# EAGLE design Projeto_Sistemas_Embarcados (EAGLE 9.7.0)
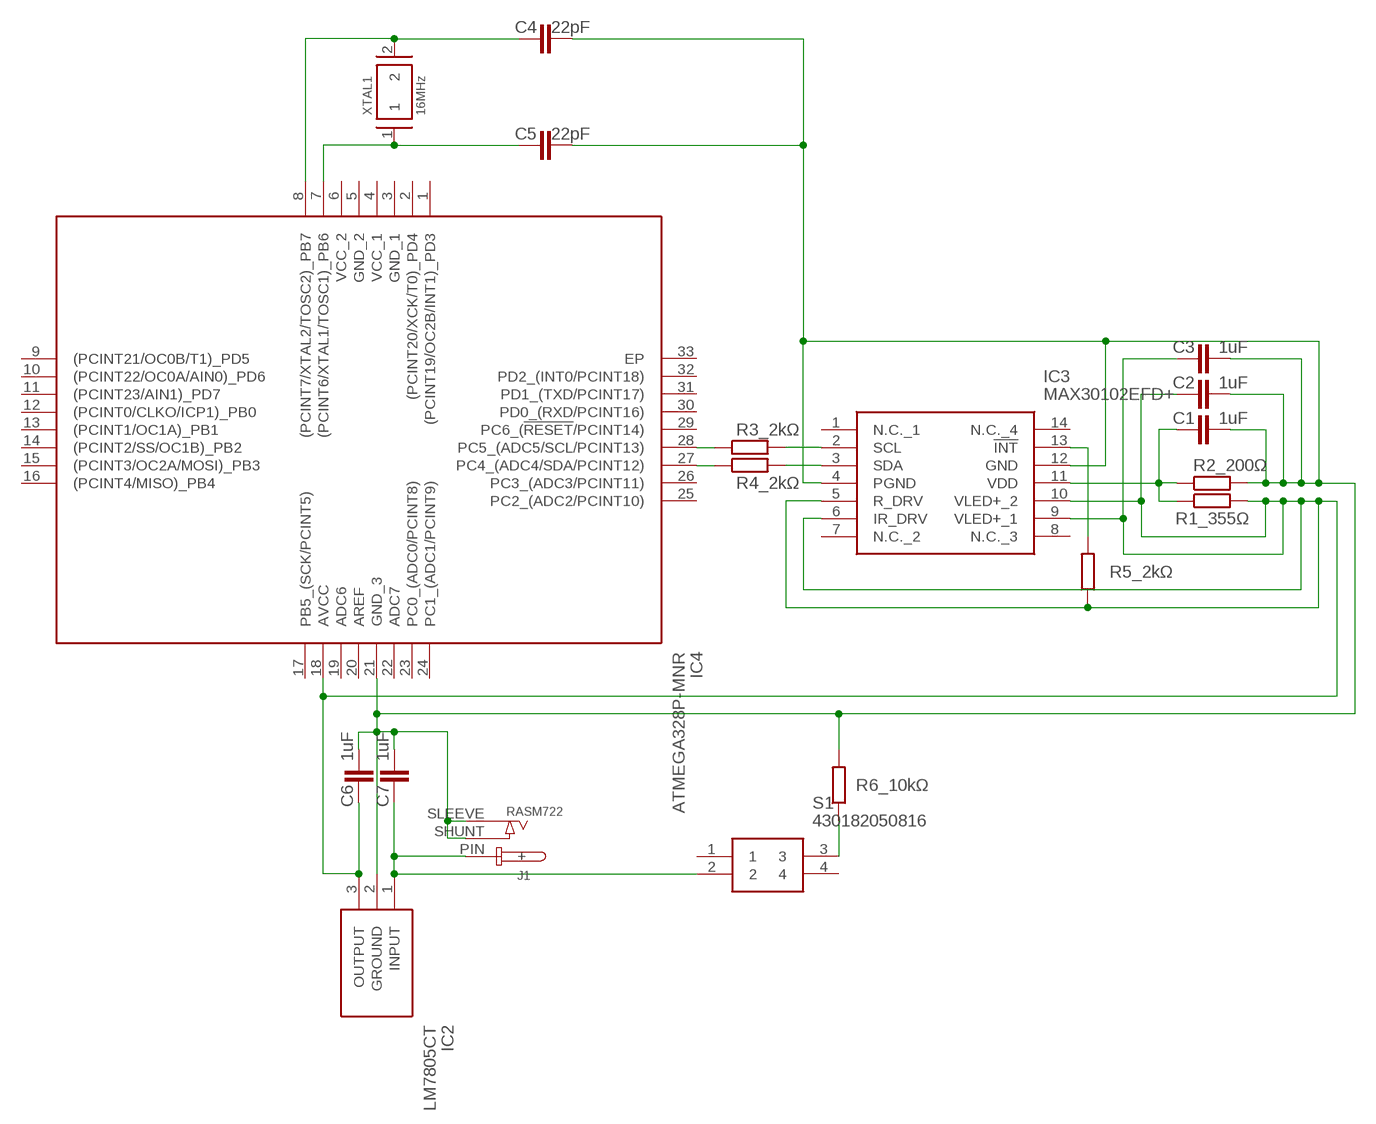
[diagram p0: schematic, sheet 1]

## Parts
C1  1uF  C_CHIP-0402(1005-METRIC)  [CAPC1005X60]
C2  1uF  C_CHIP-0402(1005-METRIC)  [CAPC1005X60]
C3  1uF  C_CHIP-0402(1005-METRIC)  [CAPC1005X60]
C4  22pF  C_CHIP-0402(1005-METRIC)  [CAPC1005X60]
C5  22pF  C_CHIP-0402(1005-METRIC)  [CAPC1005X60]
C6  1uF  C_CHIP-0402(1005-METRIC)  [CAPC1005X60]
C7  1uF  C_CHIP-0402(1005-METRIC)  [CAPC1005X60]
IC2  LM7805CT  [TO254P470X1028X1955-3P]
IC3  MAX30102EFD+  [14-LEAD-OESIP]
IC4  ATMEGA328P-MNR  [QFN50P500X500X100-33N]
J1  RASM722  [RASM722X]
R1  R1_355Ω  R_CHIP-2512(6332-METRIC)  [RESC6332X71]
R2  R2_200Ω  R_CHIP-2512(6332-METRIC)  [RESC6332X71]
R3  R3_2kΩ  R_CHIP-2512(6332-METRIC)  [RESC6332X71]
R4  R4_2kΩ  R_CHIP-2512(6332-METRIC)  [RESC6332X71]
R5  R5_2kΩ  R_CHIP-2512(6332-METRIC)  [RESC6332X71]
R6  R6_10kΩ  R_CHIP-2512(6332-METRIC)  [RESC6332X71]
S1  430182050816  [430182070816]
XTAL1  16MHz  FC4SDFREQUENCY_16MHZ  [XTAL1170X500X450N]

## Nets
5V: C2.1 C3.1 C6.1 IC2.3(OUTPUT) IC3.5(R_DRV) IC3.6(IR_DRV) IC3.9(VLED+_1) IC3.10(VLED+_2) IC4.18(AVCC) R1.2 R5.1
GND: C1.2 C2.2 C3.2 C4.2 C5.2 C6.2 C7.2 IC2.2(GROUND) IC3.4(PGND) IC3.12(GND) IC4.21(GND_3) J1.SHUNT(-) J1.SLEEVE(NEG) R2.2 R6.2
N$1: C1.1 IC3.11(VDD) R1.1 R2.1
N$2: C4.1 IC4.8((PCINT7/XTAL2/TOSC2)_PB7) XTAL1.2
N$3: C5.1 IC4.7((PCINT6/XTAL1/TOSC1)_PB6) XTAL1.1
N$4: IC3.2(SCL) R3.2
N$6: IC3.3(SDA) R4.2
N$7: R6.1 S1.3
N$8: IC3.13(!INT) R5.2
N$9: C7.1 IC2.1(INPUT) J1.PIN(+) S1.2
SCL: IC4.28(PC5_(ADC5/SCL/PCINT13)) R3.1
SDA: IC4.27(PC4_(ADC4/SDA/PCINT12)) R4.1
Unconnected: IC3.1(N.C._1) IC3.7(N.C._2) IC3.8(N.C._3) IC3.14(N.C._4) IC4.1((PCINT19/OC2B/INT1)_PD3) IC4.2((PCINT20/XCK/T0)_PD4) IC4.3(GND_1) IC4.4(VCC_1) IC4.5(GND_2) IC4.6(VCC_2) IC4.9((PCINT21/OC0B/T1)_PD5) IC4.10((PCINT22/OC0A/AIN0)_PD6) IC4.11((PCINT23/AIN1)_PD7) IC4.12((PCINT0/CLKO/ICP1)_PB0) IC4.13((PCINT1/OC1A)_PB1) IC4.14((PCINT2/SS/OC1B)_PB2) IC4.15((PCINT3/OC2A/MOSI)_PB3) IC4.16((PCINT4/MISO)_PB4) IC4.17(PB5_(SCK/PCINT5)) IC4.19(ADC6) IC4.20(AREF) IC4.22(ADC7) IC4.23(PC0_(ADC0/PCINT8)) IC4.24(PC1_(ADC1/PCINT9)) IC4.25(PC2_(ADC2/PCINT10)) IC4.26(PC3_(ADC3/PCINT11)) IC4.29(PC6_(!RESET!/PCINT14)) IC4.30(PD0_(RXD/PCINT16)) IC4.31(PD1_(TXD/PCINT17)) IC4.32(PD2_(INT0/PCINT18)) IC4.33(EP) S1.1 S1.4

## Library data of the parts
C1-C7 = Capacitor:C: Capacitor - Generic; CATEGORY: Capacitor
IC2 = LM7805CT:LM7805CT: Linear voltage regulator,LM7805CT 5V 1A Source: Datasheet <http://www.ti.com/lit/ds/symlink/lm340.pdf>; ARROW_PART_NUMBER: LM7805CT; ARROW_PRICE-STOCK: https://www.arrow.com/en/products/lm7805ct/texas-instruments; DESCRIPTION: Linear voltage regulator,LM7805CT 5V 1A; HEIGHT: 4.7mm; MANUFACTURER_NAME: Texas Instruments; MANUFACTURER_PART_NUMBER: LM7805CT; MOUSER_PART_NUMBER: 926-LM7805CT; MOUSER_PRICE-STOCK: https://www.mouser.co.uk/ProductDetail/Texas-Instruments/LM7805CT?qs=QbsRYf82W3EaqXeMDVwIfQ%3D%3D
IC3 = MAX30102EFD:MAX30102EFD+: MAXIM INTEGRATED PRODUCTS - MAX30102EFD+ - PULSE OXIMETER/HEART RATE SENSOR, OESIP Source: Datasheet <https://datasheets.maximintegrated.com/en/ds/MAX30102.pdf>; DESCRIPTION: MAXIM INTEGRATED PRODUCTS - MAX30102EFD+ - PULSE OXIMETER/HEART RATE SENSOR, OESIP; HEIGHT: mm; MANUFACTURER_NAME: Maxim Integrated; MANUFACTURER_PART_NUMBER: MAX30102EFD+; MOUSER_PART_NUMBER: 700-MAX30102EFD+; MOUSER_PRICE-STOCK: https://www.mouser.co.uk/ProductDetail/Maxim-Integrated/MAX30102EFD%2b?qs=nVS1qgv%252BQrk9UYEvS27V%2Fg%3D%3D
IC4 = ATMEGA328P:ATMEGA328P-MNR: 8-bit Microcontrollers - MCU AVR 32K FLSH 2K SRAM 1KB EE-20 MHZ 105C Source: Datasheet <http://ww1.microchip.com/downloads/en/DeviceDoc/ATmega48A-PA-88A-PA-168A-PA-328-P-DS-DS40002061A.pdf>; ARROW_PART_NUMBER: ATMEGA328P-MNR; ARROW_PRICE-STOCK: https://www.arrow.com/en/products/atmega328p-mnr/microchip-technology?region=nac; DESCRIPTION: 8-bit Microcontrollers - MCU AVR 32K FLSH 2K SRAM 1KB EE-20 MHZ 105C; HEIGHT: 1mm; MANUFACTURER_NAME: Microchip; MANUFACTURER_PART_NUMBER: ATMEGA328P-MNR; MOUSER_PART_NUMBER: 556-ATMEGA328P-MNR; MOUSER_PRICE-STOCK: https://www.mouser.co.uk/ProductDetail/Microchip-Technology-Atmel/ATMEGA328P-MNR?qs=6Dg1WZIWLC5fsr6lNbxG3A%3D%3D
J1 = Connector:RASM722: CONN PWR JACK 2.1X5.5MM SOLDER Manufacturer's datasheet <http://www.switchcraft.com/Documents/EDG4.pdf#page=135>; CREATED_BY: PCBLayout.com; DIGI-KEY_PART_NO: RASM722X-ND; MANUFACTURER: Switchcraft Inc.; MPN: RASM722X
R1-R6 = Resistor:R: Resistor Fixed - Generic; CATEGORY: Resistor; SUB-CATEGORY: Fixed
S1 = button:430182050816: Black Tactile Tactile Switch, NO 50 mA 1.6mm Surface Mount Source: Datasheet <http://katalog.we-online.de/em/datasheet/4301x2xxx8x6.pdf>; DESCRIPTION: Black Tactile Tactile Switch, NO 50 mA 1.6mm Surface Mount; HEIGHT: mm; MANUFACTURER_NAME: Wurth Elektronik; MANUFACTURER_PART_NUMBER: 430182050816; MOUSER_PART_NUMBER: 710-430182050816; MOUSER_PRICE-STOCK: https://www.mouser.co.uk/ProductDetail/Wurth-Elektronik/430182050816?qs=wr8lucFkNMUyle0jQPgWGw%3D%3D
XTAL1 = Frequency-Source:FC4SD: CRYSTAL 8.0000MHZ 20PF SMD 8MHz ±30ppm Crystal 20pF 80 Ohms HC-49/US Datasheet <https://www.foxonline.com/pdfs/C4SD.pdf>; CATEGORY: Resistance Weld; DESCRIPTION: SMD Crystal; FREQUENCY: 16MHZ; MANUFRACTURER: Fox Electronics; MPN: FC4SDCBMF16.0-T1; OPERATING_TEMPERATURE: -20*C to 70*c; PART_STATUS: Active; ROHS_COMPLIANT: COMPLIANT; SERIES: C4SD; SUB_CATEGORY: Resistance Weld SMD Crystal; TOLERANCE: ±30ppm; TYPE: Crystal

## Board
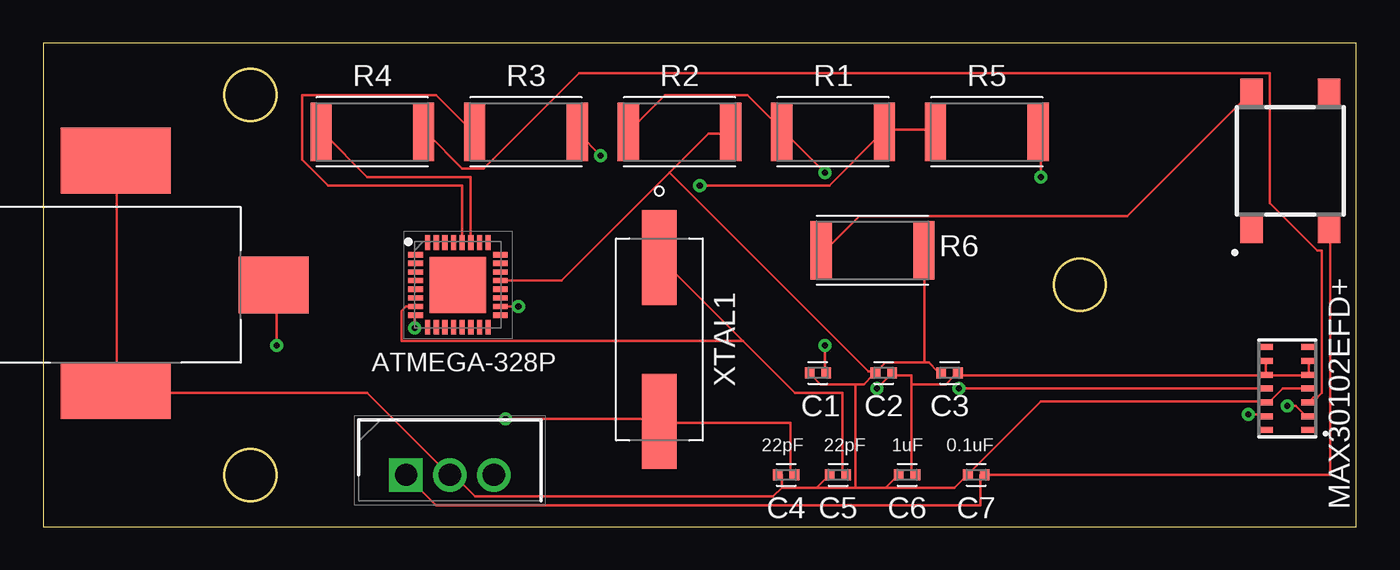
[diagram p1: board, top side]
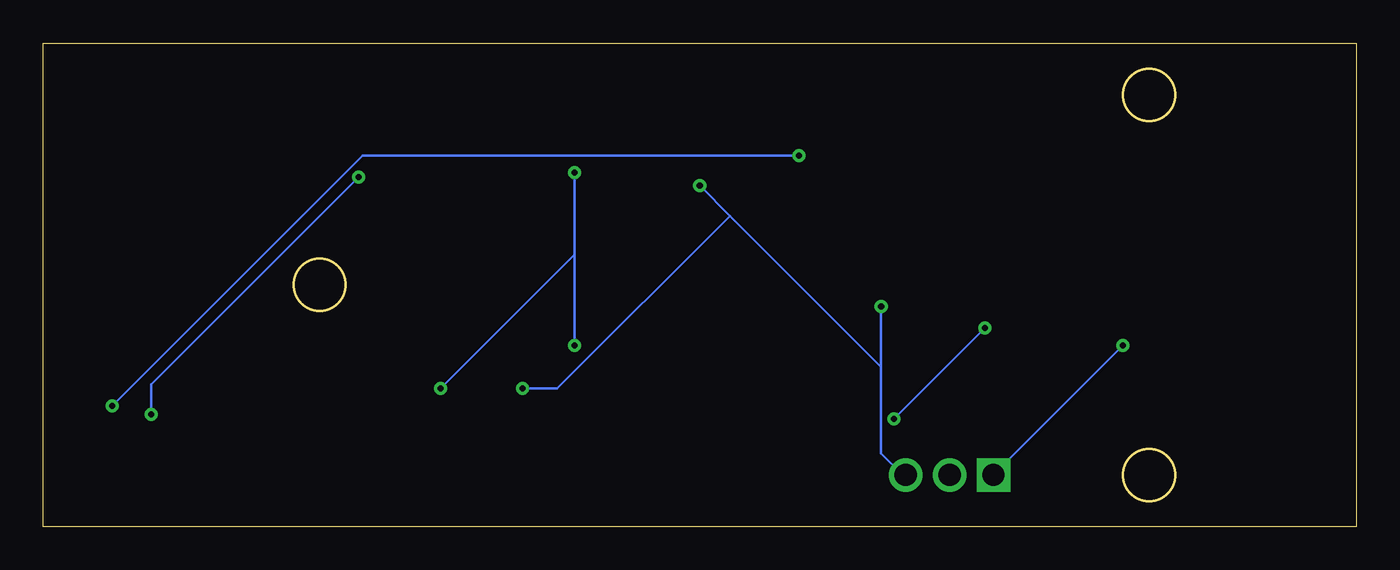
[diagram p2: board, bottom side, seen from below]

Size 76 x 28 mm. Coordinates in mm from the lower left corner, seen from the top.
Outline: 0,0 76,0 76,28 0,28 0,0
Outline: circle at 60,14 radius 1.5
Outline: circle at 12,25 radius 1.5
Outline: circle at 12,3 radius 1.5
Copper layers (1*16): Top 0.035mm / dielectric 1.5mm / Bottom 0.035mm
Design rules "default": minimum track width 6mil, minimum drill 0.35mm, track to track 6mil, track to pad 6mil, pad to pad 6mil, via to via 6mil, smd to smd 6mil, copper to edge 40mil, drill to drill 6mil, minimum pad ring 10mil, minimum via ring 8mil, stop-mask expansion 4mil, vias tented up to drill 0mil, thermal gap 10mil

### Footprints (pad centres in the part's own frame; a part is rotated, then mirrored left to right if it is on the bottom)
CAPC1005X60 = smd 0.56 x 0.629: 1 -0.485,0; 2 0.485,0
TO254P470X1028X1955-3P = drill 1.29 pad 1.935 square: 1 0,0 | drill 1.29 pad 1.935: 2 2.54,0; 3 5.08,0
14-LEAD-OESIP = smd 0.75 x 0.35: 1 -1.2,2.4; 2 -1.2,1.6; 3 -1.2,0.8; 4 -1.2,0; 5 -1.2,-0.8; 6 -1.2,-1.6; 7 -1.2,-2.4; 8 1.2,-2.4; 9 1.2,-1.6; 10 1.2,-0.8; 11 1.2,0; 12 1.2,0.8; 13 1.2,1.6; 14 1.2,2.4
QFN50P500X500X100-33N = smd 0.85 x 0.3: 1 -2.45,1.75; 2 -2.45,1.25; 3 -2.45,0.75; 4 -2.45,0.25; 5 -2.45,-0.25; 6 -2.45,-0.75; 7 -2.45,-1.25; 8 -2.45,-1.75; 17 2.45,-1.75; 18 2.45,-1.25; 19 2.45,-0.75; 20 2.45,-0.25; 21 2.45,0.25; 22 2.45,0.75; 23 2.45,1.25; 24 2.45,1.75 | smd 0.3 x 0.85: 9 -1.75,-2.45; 10 -1.25,-2.45; 11 -0.75,-2.45; 12 -0.25,-2.45; 13 0.25,-2.45; 14 0.75,-2.45; 15 1.25,-2.45; 16 1.75,-2.45; 25 1.75,2.45; 26 1.25,2.45; 27 0.75,2.45; 28 0.25,2.45; 29 -0.25,2.45; 30 -0.75,2.45; 31 -1.25,2.45; 32 -1.75,2.45 | smd 3.25 x 3.25: 33 0,0
RASM722X = smd 3.3 x 4.06: PIN 0,9.14 | smd 3.3 x 6.35: SHUNT 6.1,0 | smd 3.81 x 6.35: SLEEVE -7.19,0
RESC6332X71 = smd 1.231 x 3.37: 1 -2.97,0; 2 2.97,0
430182070816 = smd 1.55 x 1.3: 1 -3.975,2.25; 2 -3.975,-2.25; 3 3.975,2.25; 4 3.975,-2.25
XTAL1170X500X450N = smd 5.5 x 2: 1 -4.75,0; 2 4.75,0

### Placement (x,y rotation side)
C1  44.84,8.91 180 top
C2  48.65,8.91 180 top
C3  52.46,8.91 180 top
C4  43,3 180 top
C5  46,3 180 top
C6  50,3 180 top
C7  54,3 180 top
IC2  21,3 0 top
IC3  72,8 180 top
IC4  24,14 0 top
J1  4.19,14 270 top
R1  45.72,22.86 0 top
R2  36.83,22.86 0 top
R3  27.94,22.86 0 top
R4  19.05,22.86 0 top
R5  54.61,22.86 0 top
R6  48,16 0 top
S1  72.17,21.18 90 top
XTAL1  35.66,10.84 270 top

### Tracks (layer width: path | path; a pad name or v marks a point on that pad's centre or on a via)
5V  (via drill 0.35)
  Top 0.152: 70.75,8.75 70.75,9.5 IC3.9 | IC3.6 73.25,9.5 73.25,8.75 IC3.5 73,8.75 71,8.75 IC3.10 70.75,8.75 | 50.25,8.25 50.25,8.75 49.25,8.75 C2.1 49,8.75 v48.25,8 | 50.25,8.25 50.25,3 C6.1 | 50.25,8.25 52.25,8.25 52.75,8.75 C3.1 53,8.75 70.75,8.75 | R5.1 51.5,23 48.75,23 R1.2 48.5,22.75 45.5,19.75 v38,19.75 | v27.5,12.75 IC4.18
  Bottom 0.152: 27.5,9.25 27.5,4.25 26.25,3 IC2.3 | 27.5,9.25 v27.5,12.75 | 27.5,9.25 36.25,18 | 36.25,18 v38,19.75 | v48.25,8 46.25,8 36.25,18
GND
  Top 0.152: J1.SLEEVE 4.25,21 4.25,8 J1.SHUNT 4.25,7.75 18.75,7.75 23.5,3 IC2.2 23.75,3 25,1.75 42.25,1.75 42.75,2.25 | IC4.21 30,14.25 36.25,20.5 | 36.25,20.5 38.5,22.75 39.75,22.75 R2.2 | 47,8.25 47.5,8.25 48,8.75 C2.2 | 47,8.25 45,8.25 44.5,8.75 C1.2 | 51,9.5 48.75,9.5 48.25,9 C2.2 | 51,9.5 51.25,9.5 51.75,9 C3.2 | IC3.4 71.75,8 71,7.25 IC3.12 70.75,7.25 57.75,7.25 53.5,3 | 42.75,2.25 42.75,3 C4.2 | 44.75,2.25 42.75,2.25 | 44.75,2.25 45.5,3 C5.2 | 48.75,2.25 49.5,3 C6.2 | 44.75,2.25 47,2.25 | 47,2.25 48.75,2.25 | 53.5,3 52.75,2.25 48.75,2.25 | 53.5,3 C7.2 | 47,2.25 47,8.25 | 51,9.5 51,16 R6.2 | 36.25,20.5 47.75,9 48,9 C2.2
N$1  (via drill 0.35)
  Top 0.152: v45.25,10.5 45.25,9 C1.1 | v45.25,20.5 43,22.75 R1.1 42.75,23 40.75,25 36,25 34,23 R2.1 | v53,8 IC3.11
  Bottom 0.152: v45.25,20.5 45.25,15.75 | 45.25,15.75 v45.25,10.5 | 45.25,15.75 v53,8
N$2  (via drill 0.35)
  Top 0.152: C4.1 43.25,3 43.25,6 35.75,6 XTAL1.2 35.5,6.25 v26.75,6.25 | v21.5,11.5 21.5,12.25 IC4.8
  Bottom 0.152: v26.75,6.25 v21.5,11.5
N$3
  Top 0.152: XTAL1.1 40.5,10.75 | 40.5,10.75 43.5,7.75 46.25,7.75 46.25,3 C5.1 | IC4.7 21,12.75 20.75,12.5 20.75,10.75 40.5,10.75
N$4  (via drill 0.35)
  Top 0.152: v72,7 72.5,7 73,6.5 IC3.2 | v32.25,21.5 31,22.75 R3.2
  Bottom 0.152: v72,7 57.5,21.5 v32.25,21.5
N$6
  Top 0.152: IC3.3 73.5,7.5 73.75,7.5 74,7.75 74,16 73.75,16 71,18.75 71,26.25 31,26.25 25.5,20.75 24.25,20.75 22.25,22.75 R4.2
N$7
  Top 0.152: S1.3 69.75,25 62.75,18 47.25,18 45.25,16 R6.1
N$8  (via drill 0.35)
  Top 0.152: v69.75,6.5 70.75,6.5 IC3.13 | v57.75,20.25 57.75,22.75 R5.2
  Bottom 0.152: v69.75,6.5 69.75,8.25 v57.75,20.25
N$9  (via drill 0.35)
  Top 0.152: IC2.1 22.75,1.25 54.25,1.25 54.25,3 C7.1 74.5,3 74.5,17 S1.2 | v13.5,10.5 13.5,14 J1.PIN
  Bottom 0.152: IC2.1 v13.5,10.5
SCL
  Top 0.152: IC4.28 24.25,19.75 16.5,19.75 15,21.25 15,25 22.75,25 24.75,23 R3.1
SDA
  Top 0.152: IC4.27 24.75,20.25 18.75,20.25 16.25,22.75 R4.1

### Text on the board
tNames: ATMEGA-328P | C1 | 22pF | 22pF | 1uF | 0.1uF